# Altium schematic sheet Sheet1.SchDoc: 555 Timer
size Letter; DrawnBy: Christopher
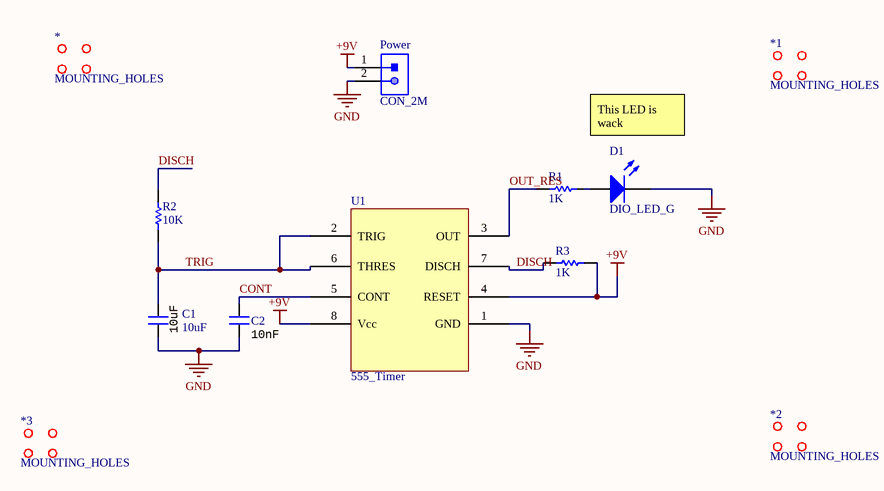
[diagram p0: Sheet1.SchDoc]

## Parts
*  MOUNTING_HOLES  [MOUNTING_HOLE]
*1  MOUNTING_HOLES  [MOUNTING_HOLE]
*2  MOUNTING_HOLES  [MOUNTING_HOLE]
*3  MOUNTING_HOLES  [MOUNTING_HOLE]
C1  10uF  [CAPC0603(1608)55_N]
C2  value 10nF  [CAPC0603(1608)55_N]  (hidden comment: CAP_10nF_0603)
D1  DIO_LED_G  [LED_0805_LINE]
Power  CON_2M  [JST-B2B-PHSK]
R1  value 1K  [RESC0603(1608)_N]  (hidden comment: RES_1K_0603)
R2  value 10K  [RESC0603(1608)_N]  (hidden comment: RES_10K_0603)
R3  value 1K  [RESC0603(1608)_N]  (hidden comment: RES_1K_0603)
U1  555_Timer

## Nets
+9V: Power.1 R3.2 U1.4(RESET) U1.8(Vcc)
GND: C1.1 C2.1 D1.2(K) Power.2 U1.1(GND)
CONT: C2.2 U1.5(CONT)
DISCH: R2.2 R3.1 U1.7(DISCH)
OUT_RES: R1.1 U1.3(OUT)
TRIG: C1.2 R2.1 U1.2(TRIG) U1.6(THRES)
NetD1_1: D1.1(A) R1.2

## Notes on the sheet
- This LED is wack
- Title
- Size:
- Date:
- Letter
- Drawn By:
- Sheet
- of
- File:

## Library data of the parts
* *1-*3 = MOUNTING_HOLES: 6cm x 6cm
C1 = CAP_10uF_0603: CAP CER 10UF 10V X5R 0603; MPN: CC0603MRX5R6BB106; Manufacturer: Yageo; Dimensions: 0.063" L x 0.031" W (1.60mm x 0.80mm); Package: 0603 (1608 Metric); Voltage Rating: 10V; Digikey Part Number: 311-1817-1-ND; Value: 10uF
C2 = CAP_10nF_0603: CAP CER 10000PF 16V X7R 0603; MPN: CC0603KRX7R7BB103; Manufacturer: Yageo; Dimensions: 0.063" L x 0.031" W (1.60mm x 0.80mm); Package: 0603 (1608 Metric); Temperature Coefficient: X7R; Voltage Rating: 16V; Digikey Part Number: 311-3369-1-ND
D1 = DIO_LED_G: LED GREEN DIFFUSED 0805 SMD; MPN: LG R971-KN-1; Manufacturer: OSRAM; Forward Voltage Drop: 2.2V; Package: 0805 (2012 Metric); Digikey Part Number: 475-1410-1-ND
R1 R3 = RES_1K_0603: RES SMD 1K OHM 5% 1/10W 0603; Manufacturer: Yageo; MPN: RC0603JR-071KL; Dimensions: 0.063" L x 0.031" W (1.60mm x 0.80mm); Tolerance: 5%; Package: 0603 (1608 Metric); Digikey Part Number: 311-1.0KGRCT-ND
R2 = RES_10K_0603: RES SMD 10K OHM 5% 1/10W 0603; Manufacturer: Yageo; MPN: RC0603JR-0710KL; Package: 0603 (1608 Metric); Dimensions: 0.063" L x 0.031" W (1.60mm x 0.80mm); Tolerance: 5%; Digikey Part Number: 311-10KGRCT-ND